# Altium schematic sheet FiltroRF.SchDoc
size A4
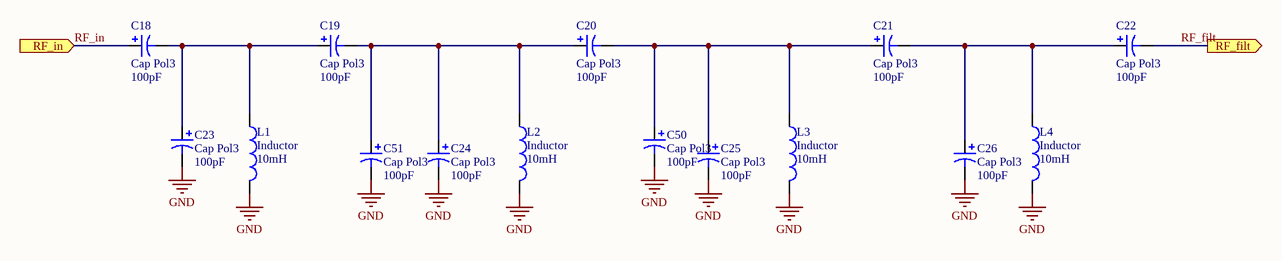
[diagram p0: FiltroRF.SchDoc]

## Parts
C18  Cap Pol3  value 100pF  [C0805]
C19  Cap Pol3  value 100pF  [C0805]
C20  Cap Pol3  value 100pF  [C0805]
C21  Cap Pol3  value 100pF  [C0805]
C22  Cap Pol3  value 100pF  [C0805]
C23  Cap Pol3  value 100pF  [C0805]
C24  Cap Pol3  value 100pF  [C0805]
C25  Cap Pol3  value 100pF  [C0805]
C26  Cap Pol3  value 100pF  [C0805]
C50  Cap Pol3  value 100pF  [C0805]
C51  Cap Pol3  value 100pF  [C0805]
L1  Inductor  value 10mH  [3261]
L2  Inductor  value 10mH  [3261]
L3  Inductor  value 10mH  [3261]
L4  Inductor  value 10mH  [3261]

## Ports
RF_filt (out), RF_in (in)

## Nets
GND: C23.2 C24.2 C25.2 C26.2 C50.2 C51.2 L1.2 L2.2 L3.2 L4.2
RF_filt: C22.2 ; port RF_filt
RF_in: C18.1 ; port RF_in
NetC18_2: C18.2 C19.1 C23.1 L1.1
NetC19_2: C19.2 C20.1 C24.1 C51.1 L2.1
NetC20_2: C20.2 C21.1 C25.1 C50.1 L3.1
NetC21_2: C21.2 C22.1 C26.1 L4.1

## Library data of the parts
C18-C26 C50 C51 = Cap Pol3: Polarized Capacitor (Surface Mount); Published: 8-Jun-2000; LatestRevisionDate: 17-Jul-2002; LatestRevisionNote: Re-released for DXP Platform.; PackageReference: C0805; Publisher: Altium Limited
L1-L4 = Inductor: Code_IEC: 1005; Published: 8-Jun-2000; LatestRevisionDate: 17-Jul-2002; LatestRevisionNote: Re-released for DXP Platform.; PackageReference: 0402-A; Publisher: Altium Limited; Code_JEITA: 0402